# Altium schematic sheet Supply-STM32.SchDoc
size A4; SheetNumber: 2; SheetTotal: 2
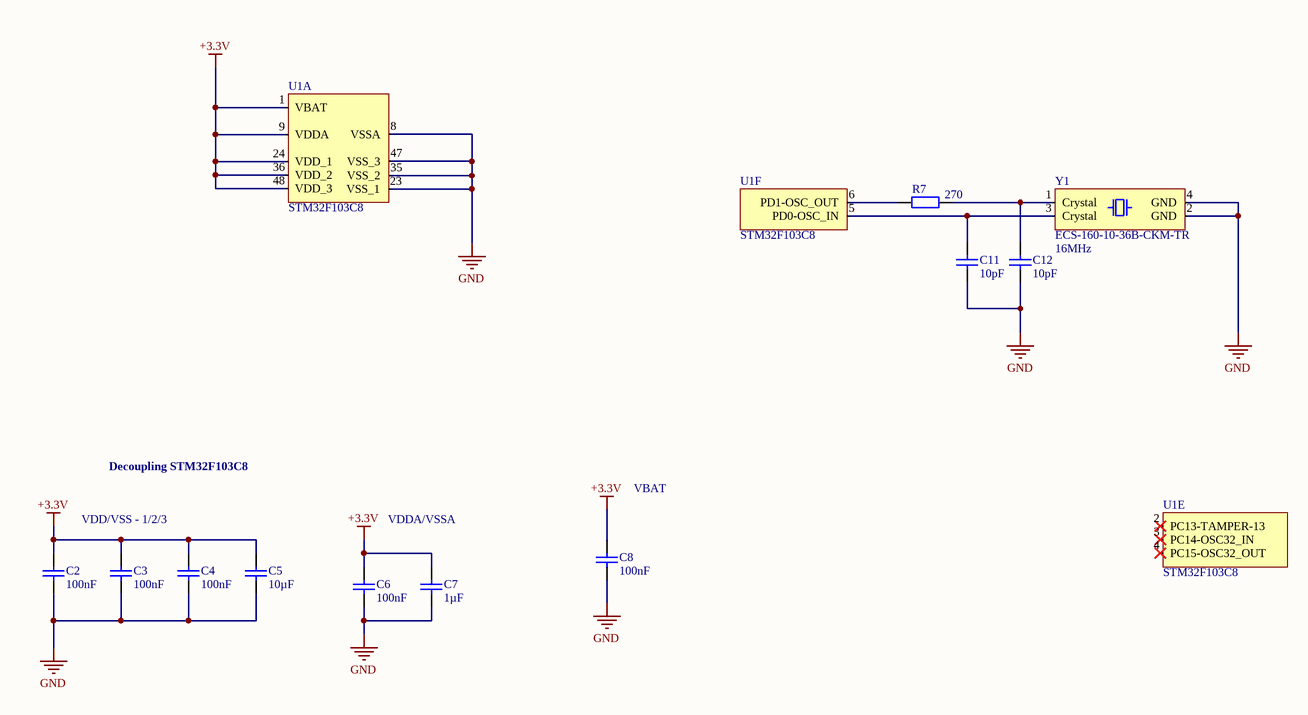
[diagram p0: Supply-STM32.SchDoc]

## Parts
C2  value 100nF  [CAP_0603]  (hidden comment: CAP)
C3  value 100nF  [CAP_0603]  (hidden comment: CAP)
C4  value 100nF  [CAP_0603]  (hidden comment: CAP)
C5  value 10µF  [CAP_0603]  (hidden comment: CAP)
C6  value 100nF  [CAP_0603]  (hidden comment: CAP)
C7  value 1µF  [CAP_0603]  (hidden comment: CAP)
C8  value 100nF  [CAP_0603]  (hidden comment: CAP)
C11  value 10pF  [CAP_0603]  (hidden comment: CAP)
C12  value 10pF  [CAP_0603]  (hidden comment: CAP)
R7  value 270  [RES_0603]  (hidden comment: RES)
U1  STM32F103C8  [LQFP48P05S97X97]  (parts A,E,F of 6)
Y1  ECS-160-10-36B-CKM-TR  Parameter 1: 16MHz  [Crystal_16MHz]

## Nets
+3.3V: C2.2 C3.2 C4.2 C5.2 C6.2 C7.2 C8.2 U1.1(VBAT) U1.9(VDDA) U1.24(VDD_1) U1.36(VDD_2) U1.48(VDD_3)
GND: C2.1 C3.1 C4.1 C5.1 C6.1 C7.1 C8.1 C11.1 C12.1 U1.8(VSSA) U1.23(VSS_1) U1.35(VSS_2) U1.47(VSS_3) Y1.2(GND) Y1.4(GND)
NetC11_2: C11.2 U1.5(PD0-OSC_IN) Y1.3(Crystal)
NetC12_2: C12.2 R7.1 Y1.1(Crystal)
NetR7_2: R7.2 U1.6(PD1-OSC_OUT)

Not connected (* = marked no-connect by the designer): U1 2(PC13-TAMPER-13)* 3(PC14-OSC32_IN)* 4(PC15-OSC32_OUT)*

## Notes on the sheet
- Decoupling STM32F103C8
- VDD/VSS - 1/2/3
- VDDA/VSSA
- VBAT
- Title
- Size:
- Date:
- A4
- Number:
- Time:
- Revision:
- Sheet
- of
- Drawn by:
- File:

## Library data of the parts
C2-C8 C11 C12 = CAP
  C8 C11 C12: Manufacturer Number: *; Manufacturer: *; Distributor: *; Distributor Number: *
R7 = RES: Manufacturer Number: *; Manufacturer: *; Distributor: *; Distributor Number: *